# Altium schematic sheet CoreBoard.SchDoc
size A1
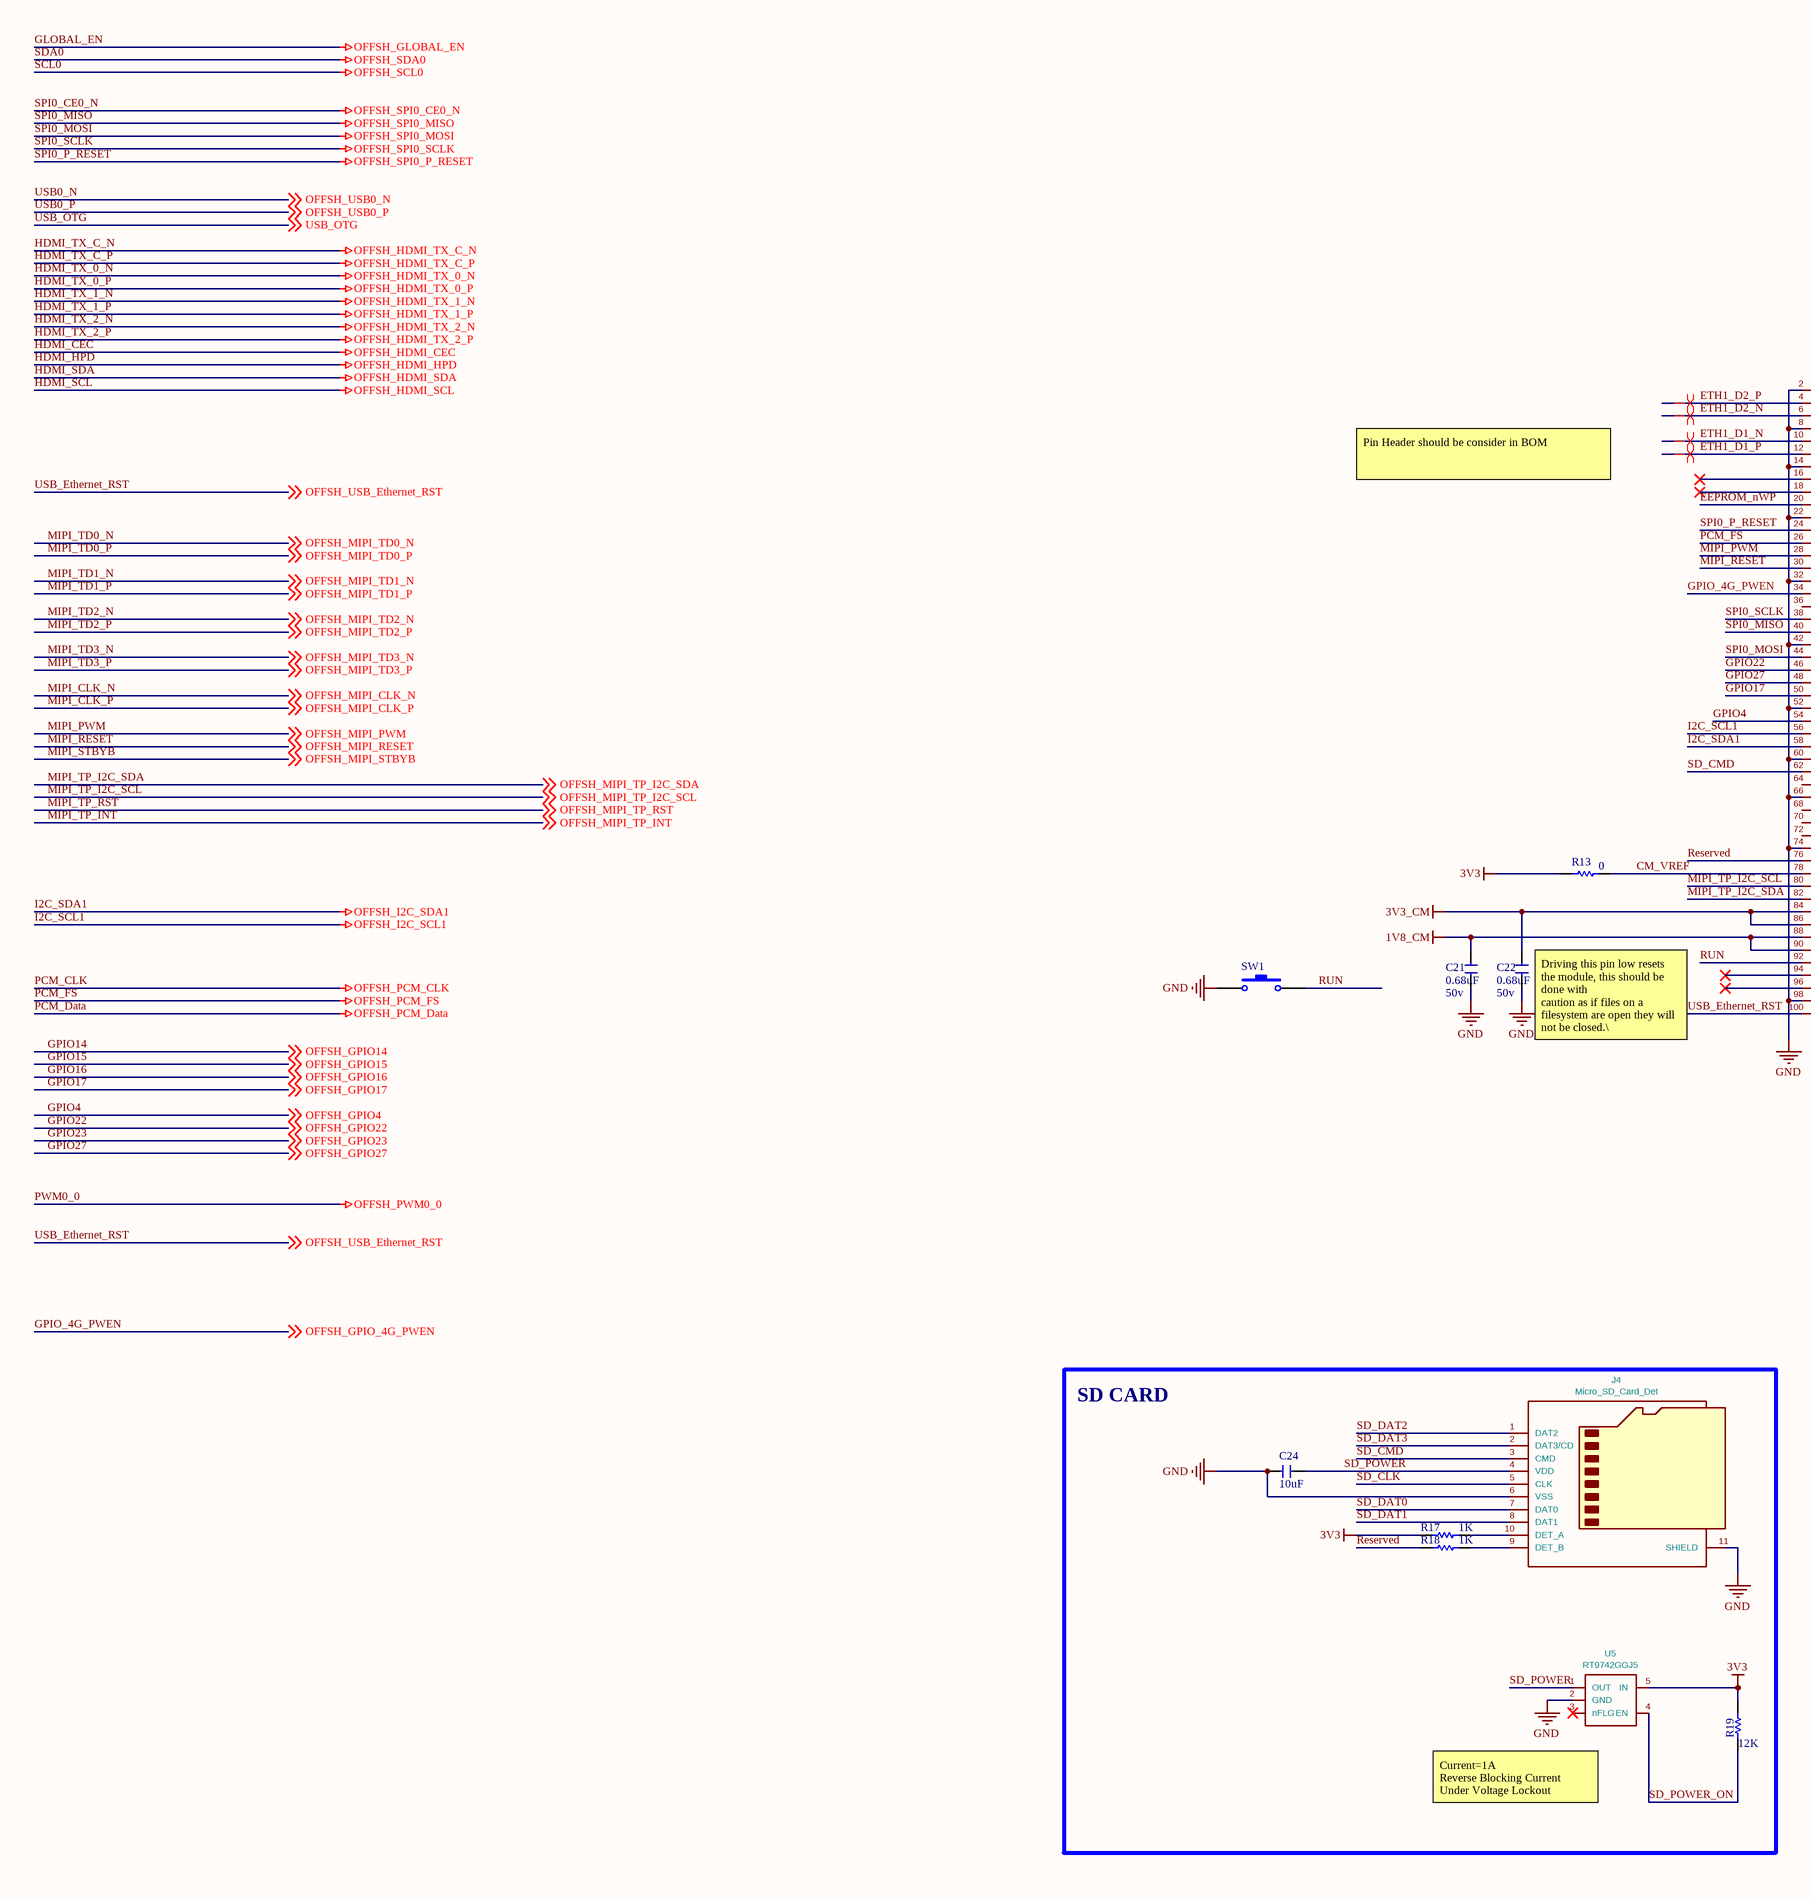
[diagram p0: CoreBoard.SchDoc, left]
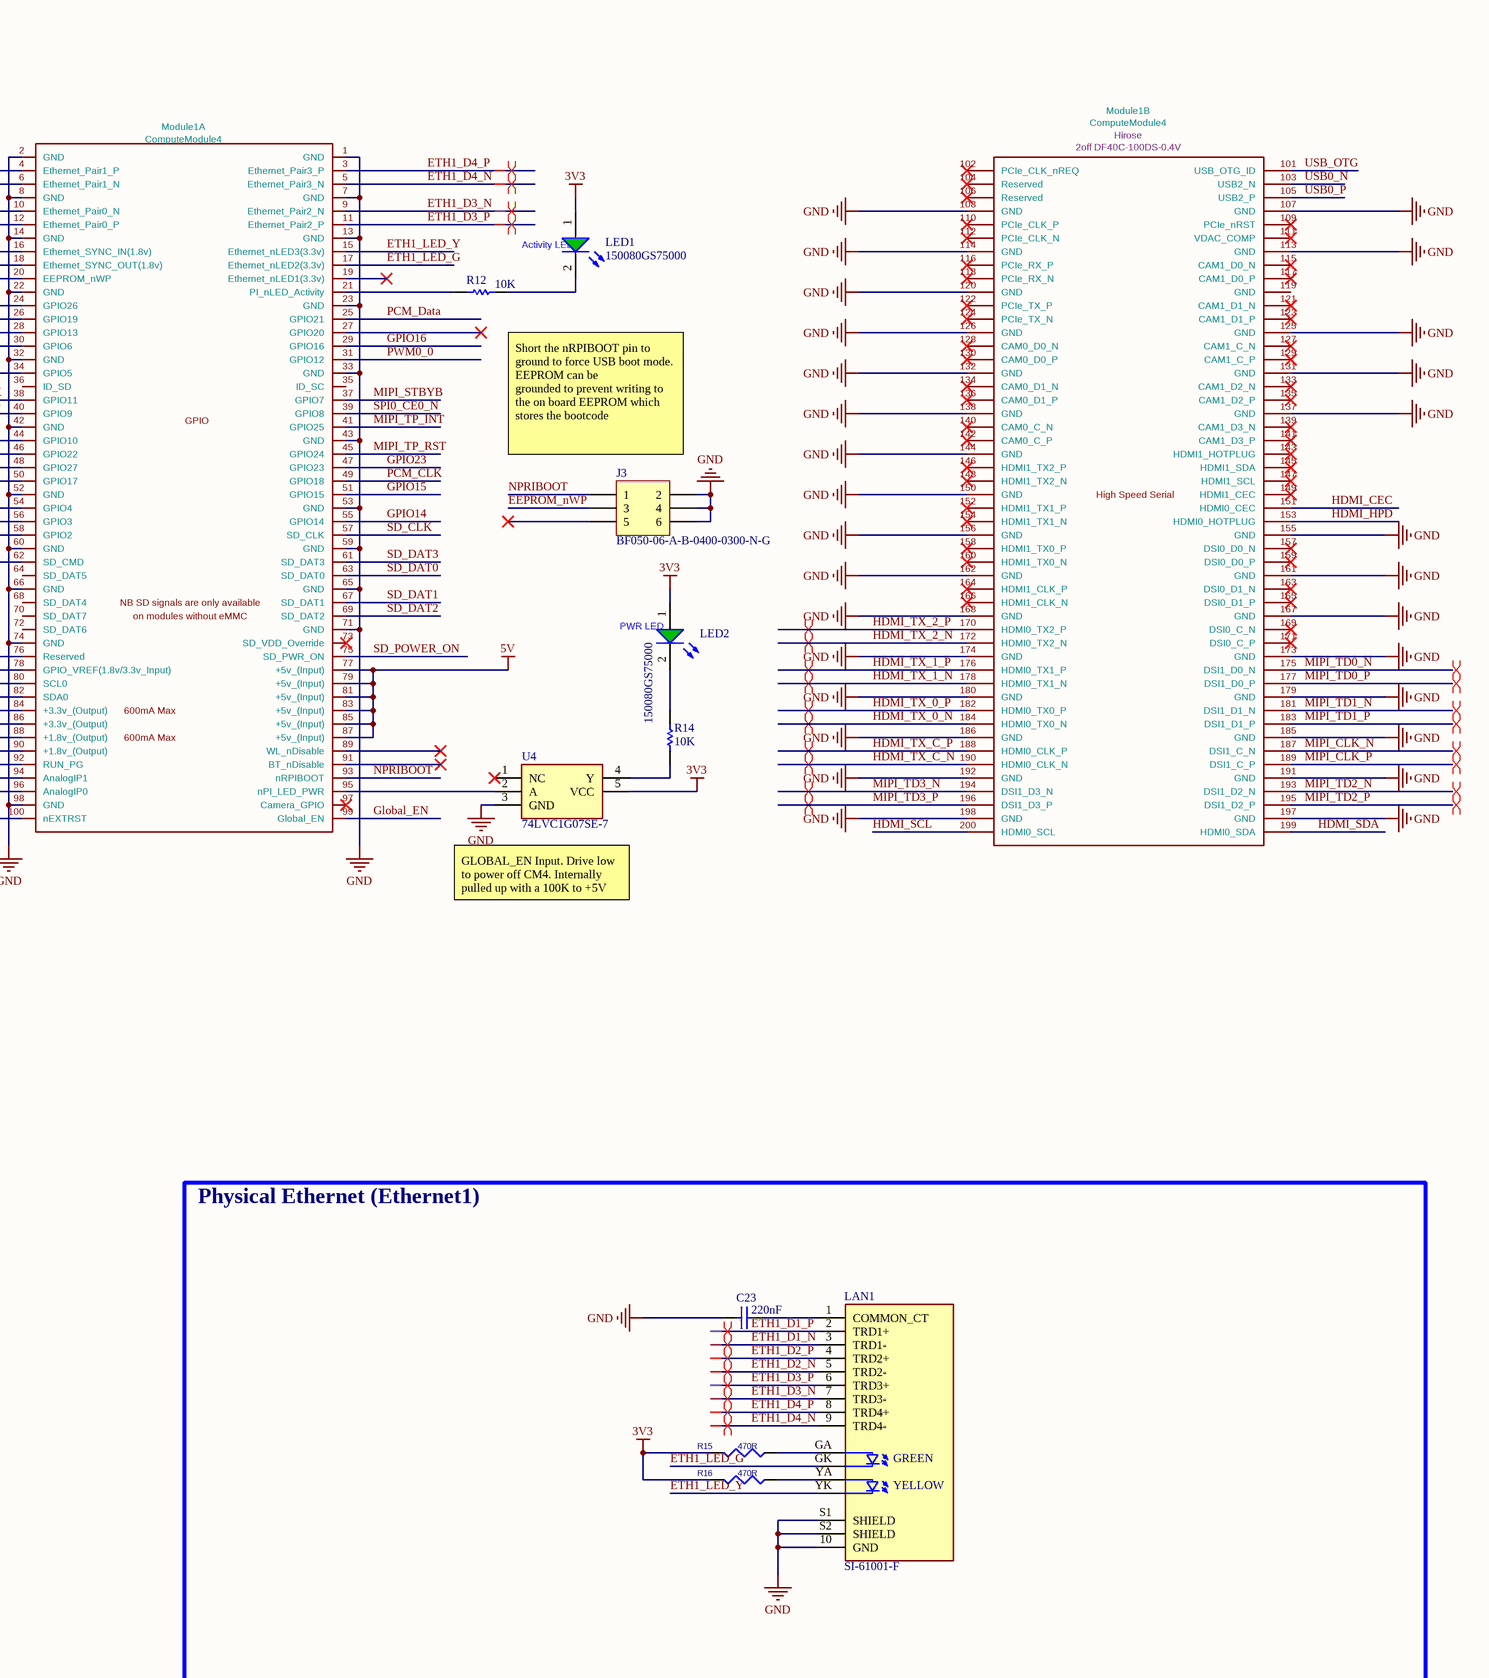
[diagram p1: CoreBoard.SchDoc, right]

## Parts
C21  value 0.68uF  Voltage: 50v  [0603 Capacitor]  (hidden comment: Capacitor SMD)
C22  value 0.68uF  Voltage: 50v  [0603 Capacitor]  (hidden comment: Capacitor SMD)
C23  value 220nF  [CAP (0603)]  (hidden comment: Cap)
C24  value 10uF  [0603 Capacitor]  (hidden comment: Capacitor SMD)
J3  Pin Header pitch 2.00 mm, 6 pin  [BF050-06-A-B-0400-0300-N-G]  (value not drawn)
J4  Micro_SD_Card_Det  [SDCARD_MOLEX_503398-1892]
LAN1  SI-61001-F  [BEL_SI-61001-F]
LED1  150080GS75000  [LED_0805_Green]
LED2  150080GS75000  [LED_0805_Green]
Module1  ComputeModule4  [Raspberry-Pi-4-Compute-Module]  (parts A,B of 2)
R12  value 10K  [R0603]  (hidden comment: Res)
R13  value 0  [R0603]  (hidden comment: Res)
R14  value 10K  [R0603]  (hidden comment: Res)
R15  470R  [R0603]
R16  470R  [R0603]
R17  value 1K  [R0603]  (hidden comment: Res)
R18  value 1K  [R0603]  (hidden comment: Res)
R19  value 12K  [R0603]  (hidden comment: Res)
SW1  (no value)  [Key_Tak Switch - Push to On]
U4  74LVC1G07SE-7  [SOT65P210X110-5N]
U5  RT9742GGJ5  [SOT-23-5]

## Blocks framed on the sheet
SD CARD: C24 J4 R17-R19 U5
Physical Ethernet (Ethernet1): C23 LAN1 R15 R16

## Nets
1V8_CM: C21.2 Module1.88(+1.8v_(Output)) Module1.90(+1.8v_(Output))
3V3: LED1.1(A) LED2.1(A) R13.2 R15.1 R16.1 R17.2 R19.2 U4.5(VCC) U5.5(IN)
3V3_CM: C22.2 Module1.84(+3.3v_(Output)) Module1.86(+3.3v_(Output))
5V: Module1.77(+5v_(Input)) Module1.79(+5v_(Input)) Module1.81(+5v_(Input)) Module1.83(+5v_(Input)) Module1.85(+5v_(Input)) Module1.87(+5v_(Input))
Global_EN: Module1.99(Global_EN)  [also labelled OFFSH_GLOBAL_EN]
GND: C21.1 C22.1 C23.1 C24.2 J3.2 J3.4 J3.6 J4.6(VSS) J4.11(SHIELD) LAN1.10(GND) LAN1.S1(SHIELD) LAN1.S2(SHIELD) Module1.1(GND) Module1.2(GND) Module1.7(GND) Module1.8(GND) Module1.13(GND) Module1.14(GND) Module1.22(GND) Module1.23(GND) Module1.32(GND) Module1.33(GND) Module1.42(GND) Module1.43(GND) Module1.52(GND) Module1.53(GND) Module1.59(GND) Module1.60(GND) Module1.65(GND) Module1.66(GND) Module1.71(GND) Module1.74(GND) Module1.98(GND) Module1.107(GND) Module1.108(GND) Module1.113(GND) Module1.114(GND) Module1.120(GND) Module1.125(GND) Module1.126(GND) Module1.131(GND) Module1.132(GND) Module1.137(GND) Module1.138(GND) Module1.144(GND) Module1.150(GND) Module1.155(GND) Module1.156(GND) Module1.161(GND) Module1.162(GND) Module1.167(GND) Module1.168(GND) Module1.173(GND) Module1.174(GND) Module1.179(GND) Module1.180(GND) Module1.185(GND) Module1.186(GND) Module1.191(GND) Module1.192(GND) Module1.197(GND) Module1.198(GND) SW1.1 U4.3(GND) U5.2(GND)
HDMI_CEC: Module1.151(HDMI0_CEC)  [also labelled OFFSH_HDMI_CEC]
HDMI_HPD: Module1.153(HDMI0_HOTPLUG)  [also labelled OFFSH_HDMI_HPD]
HDMI_SCL: Module1.200(HDMI0_SCL)  [also labelled OFFSH_HDMI_SCL]
HDMI_SDA: Module1.199(HDMI0_SDA)  [also labelled OFFSH_HDMI_SDA]
HDMI_TX_0_N: Module1.184(HDMI0_TX0_N)  [also labelled OFFSH_HDMI_TX_0_N]
HDMI_TX_0_P: Module1.182(HDMI0_TX0_P)  [also labelled OFFSH_HDMI_TX_0_P]
HDMI_TX_1_N: Module1.178(HDMI0_TX1_N)  [also labelled OFFSH_HDMI_TX_1_N]
HDMI_TX_1_P: Module1.176(HDMI0_TX1_P)  [also labelled OFFSH_HDMI_TX_1_P]
HDMI_TX_2_N: Module1.172(HDMI0_TX2_N)  [also labelled OFFSH_HDMI_TX_2_N]
HDMI_TX_2_P: Module1.170(HDMI0_TX2_P)  [also labelled OFFSH_HDMI_TX_2_P]
HDMI_TX_C_N: Module1.190(HDMI0_CLK_N)  [also labelled OFFSH_HDMI_TX_C_N]
HDMI_TX_C_P: Module1.188(HDMI0_CLK_P)  [also labelled OFFSH_HDMI_TX_C_P]
I2C_SCL1: Module1.56(GPIO3)  [also labelled OFFSH_I2C_SCL1]
I2C_SDA1: Module1.58(GPIO2)  [also labelled OFFSH_I2C_SDA1]
PCM_CLK: Module1.49(GPIO18)  [also labelled OFFSH_PCM_CLK]
PCM_Data: Module1.25(GPIO21)  [also labelled OFFSH_PCM_Data]
PCM_FS: Module1.26(GPIO19)  [also labelled OFFSH_PCM_FS]
PWM0_0: Module1.31(GPIO12)  [also labelled OFFSH_PWM0_0]
SPI0_CE0_N: Module1.39(GPIO8)  [also labelled OFFSH_SPI0_CE0_N]
SPI0_MISO: Module1.40(GPIO9)  [also labelled OFFSH_SPI0_MISO]
SPI0_MOSI: Module1.44(GPIO10)  [also labelled OFFSH_SPI0_MOSI]
SPI0_P_RESET: Module1.24(GPIO26)  [also labelled OFFSH_SPI0_P_RESET]
SPI0_SCLK: Module1.38(GPIO11)  [also labelled OFFSH_SPI0_SCLK]
CM_VREF: Module1.78(GPIO_VREF(1.8v/3.3v_Input)) R13.1
EEPROM_nWP: J3.3 Module1.20(EEPROM_nWP)
ETH1_D1_N: LAN1.3(TRD1-) Module1.10(Ethernet_Pair0_N)
ETH1_D1_P: LAN1.2(TRD1+) Module1.12(Ethernet_Pair0_P)
ETH1_D2_N: LAN1.5(TRD2-) Module1.6(Ethernet_Pair1_N)
ETH1_D2_P: LAN1.4(TRD2+) Module1.4(Ethernet_Pair1_P)
ETH1_D3_N: LAN1.7(TRD3-) Module1.9(Ethernet_Pair2_N)
ETH1_D3_P: LAN1.6(TRD3+) Module1.11(Ethernet_Pair2_P)
ETH1_D4_N: LAN1.9(TRD4-) Module1.5(Ethernet_Pair3_N)
ETH1_D4_P: LAN1.8(TRD4+) Module1.3(Ethernet_Pair3_P)
ETH1_LED_G: LAN1.GK Module1.17(Ethernet_nLED2(3.3v))
ETH1_LED_Y: LAN1.YK Module1.15(Ethernet_nLED3(3.3v))
GPIO4: Module1.54(GPIO4) ; off-sheet OFFSH_GPIO4  [also labelled OFFSH_GPIO4]
GPIO14: Module1.55(GPIO14) ; off-sheet OFFSH_GPIO14  [also labelled OFFSH_GPIO14]
GPIO15: Module1.51(GPIO15) ; off-sheet OFFSH_GPIO15  [also labelled OFFSH_GPIO15]
GPIO16: Module1.29(GPIO16) ; off-sheet OFFSH_GPIO16  [also labelled OFFSH_GPIO16]
GPIO17: Module1.50(GPIO17) ; off-sheet OFFSH_GPIO17  [also labelled OFFSH_GPIO17]
GPIO22: Module1.46(GPIO22) ; off-sheet OFFSH_GPIO22  [also labelled OFFSH_GPIO22]
GPIO23: Module1.47(GPIO23) ; off-sheet OFFSH_GPIO23  [also labelled OFFSH_GPIO23]
GPIO27: Module1.48(GPIO27) ; off-sheet OFFSH_GPIO27  [also labelled OFFSH_GPIO27]
GPIO_4G_PWEN: Module1.34(GPIO5) ; off-sheet OFFSH_GPIO_4G_PWEN  [also labelled OFFSH_GPIO_4G_PWEN]
MIPI_CLK_N: Module1.187(DSI1_C_N) ; off-sheet OFFSH_MIPI_CLK_N  [also labelled OFFSH_MIPI_CLK_N]
MIPI_CLK_P: Module1.189(DSI1_C_P) ; off-sheet OFFSH_MIPI_CLK_P  [also labelled OFFSH_MIPI_CLK_P]
MIPI_PWM: Module1.28(GPIO13) ; off-sheet OFFSH_MIPI_PWM  [also labelled OFFSH_MIPI_PWM]
MIPI_RESET: Module1.30(GPIO6) ; off-sheet OFFSH_MIPI_RESET  [also labelled OFFSH_MIPI_RESET]
MIPI_STBYB: Module1.37(GPIO7) ; off-sheet OFFSH_MIPI_STBYB  [also labelled OFFSH_MIPI_STBYB]
MIPI_TD0_N: Module1.175(DSI1_D0_N) ; off-sheet OFFSH_MIPI_TD0_N  [also labelled OFFSH_MIPI_TD0_N]
MIPI_TD0_P: Module1.177(DSI1_D0_P) ; off-sheet OFFSH_MIPI_TD0_P  [also labelled OFFSH_MIPI_TD0_P]
MIPI_TD1_N: Module1.181(DSI1_D1_N) ; off-sheet OFFSH_MIPI_TD1_N  [also labelled OFFSH_MIPI_TD1_N]
MIPI_TD1_P: Module1.183(DSI1_D1_P) ; off-sheet OFFSH_MIPI_TD1_P  [also labelled OFFSH_MIPI_TD1_P]
MIPI_TD2_N: Module1.193(DSI1_D2_N) ; off-sheet OFFSH_MIPI_TD2_N  [also labelled OFFSH_MIPI_TD2_N]
MIPI_TD2_P: Module1.195(DSI1_D2_P) ; off-sheet OFFSH_MIPI_TD2_P  [also labelled OFFSH_MIPI_TD2_P]
MIPI_TD3_N: Module1.194(DSI1_D3_N) ; off-sheet OFFSH_MIPI_TD3_N  [also labelled OFFSH_MIPI_TD3_N]
MIPI_TD3_P: Module1.196(DSI1_D3_P) ; off-sheet OFFSH_MIPI_TD3_P  [also labelled OFFSH_MIPI_TD3_P]
MIPI_TP_I2C_SCL: Module1.80(SCL0) ; off-sheet OFFSH_MIPI_TP_I2C_SCL  [also labelled OFFSH_MIPI_TP_I2C_SCL]
MIPI_TP_I2C_SDA: Module1.82(SDA0) ; off-sheet OFFSH_MIPI_TP_I2C_SDA  [also labelled OFFSH_MIPI_TP_I2C_SDA]
MIPI_TP_INT: Module1.41(GPIO25) ; off-sheet OFFSH_MIPI_TP_INT  [also labelled OFFSH_MIPI_TP_INT]
MIPI_TP_RST: Module1.45(GPIO24) ; off-sheet OFFSH_MIPI_TP_RST  [also labelled OFFSH_MIPI_TP_RST]
NPRIBOOT: J3.1 Module1.93(nRPIBOOT)
Reserved: Module1.76(Reserved) R18.2
RUN: Module1.92(RUN_PG) SW1.2
SD_CLK: J4.5(CLK) Module1.57(SD_CLK)
SD_CMD: J4.3(CMD) Module1.62(SD_CMD)
SD_DAT0: J4.7(DAT0) Module1.63(SD_DAT0)
SD_DAT1: J4.8(DAT1) Module1.67(SD_DAT1)
SD_DAT2: J4.1(DAT2) Module1.69(SD_DAT2)
SD_DAT3: J4.2(DAT3/CD) Module1.61(SD_DAT3)
SD_POWER: C24.1 J4.4(VDD) U5.1(OUT)
SD_POWER_ON: Module1.75(SD_PWR_ON) R19.1 U5.4(EN)
USB0_N: Module1.103(USB2_N) ; off-sheet OFFSH_USB0_N  [also labelled OFFSH_USB0_N]
USB0_P: Module1.105(USB2_P) ; off-sheet OFFSH_USB0_P  [also labelled OFFSH_USB0_P]
USB_Ethernet_RST: Module1.100(nEXTRST) ; off-sheet OFFSH_USB_Ethernet_RST  [also labelled OFFSH_USB_Ethernet_RST]
USB_OTG: Module1.101(USB_OTG_ID) ; off-sheet USB_OTG
NetC23_2: C23.2 LAN1.1(COMMON_CT)
NetJ4_9: J4.9(DET_B) R18.1
NetJ4_10: J4.10(DET_A) R17.1
NetLAN1_GA: LAN1.GA R15.2
NetLAN1_YA: LAN1.YA R16.2
NetLED1_2: LED1.2(C) R12.1
NetLED2_2: LED2.2(C) R14.1
NetModule1_21: Module1.21(PI_nLED_Activity) R12.2
NetModule1_95: Module1.95(nPI_LED_PWR) U4.2(A)
NetR14_2: R14.2 U4.4(Y)

Not connected (* = marked no-connect by the designer): J3 5*; Module1 16(Ethernet_SYNC_IN(1.8v))* 18(Ethernet_SYNC_OUT(1.8v))* 19(Ethernet_nLED1(3.3v))* 27(GPIO20)* 35(ID_SC) 36(ID_SD) 64(SD_DAT5) 68(SD_DAT4) 70(SD_DAT7) 72(SD_DAT6) 73(SD_VDD_Override)* 89(WL_nDisable)* 91(BT_nDisable)* 94(AnalogIP1)* 96(AnalogIP0)* 97(Camera_GPIO)* 102(PCIe_CLK_nREQ)* 104(Reserved)* 106(Reserved)* 109(PCIe_nRST)* 110(PCIe_CLK_P)* 111(VDAC_COMP)* 112(PCIe_CLK_N)* 115(CAM1_D0_N)* 116(PCIe_RX_P)* 117(CAM1_D0_P)* 118(PCIe_RX_N)* 119(GND) 121(CAM1_D1_N)* 122(PCIe_TX_P)* 123(CAM1_D1_P)* 124(PCIe_TX_N)* 127(CAM1_C_N)* 128(CAM0_D0_N)* 129(CAM1_C_P)* 130(CAM0_D0_P)* 133(CAM1_D2_N)* 134(CAM0_D1_N)* 135(CAM1_D2_P)* 136(CAM0_D1_P)* 139(CAM1_D3_N)* 140(CAM0_C_N)* 141(CAM1_D3_P)* 142(CAM0_C_P)* 143(HDMI1_HOTPLUG)* 145(HDMI1_SDA)* 146(HDMI1_TX2_P)* 147(HDMI1_SCL)* 148(HDMI1_TX2_N)* 149(HDMI1_CEC)* 152(HDMI1_TX1_P)* 154(HDMI1_TX1_N)* 157(DSI0_D0_N)* 158(HDMI1_TX0_P)* 159(DSI0_D0_P)* 160(HDMI1_TX0_N)* 163(DSI0_D1_N)* 164(HDMI1_CLK_P)* 165(DSI0_D1_P)* 166(HDMI1_CLK_N)* 169(DSI0_C_N)* 171(DSI0_C_P)*; U4 1(NC)*; U5 3(nFLG)*

## Layout directives
differential pair; net class MIPI: MIPI_CLK_N, MIPI_CLK_P, MIPI_TD0_N, MIPI_TD0_P, MIPI_TD1_N, MIPI_TD1_P, MIPI_TD2_N, MIPI_TD2_P
differential pair: ETH1_D1_N, ETH1_D1_P, ETH1_D2_N, ETH1_D2_P, ETH1_D3_N, ETH1_D3_P, ETH1_D4_N, ETH1_D4_P, HDMI_TX_0_N, HDMI_TX_0_P, HDMI_TX_1_N, HDMI_TX_1_P, HDMI_TX_2_N, HDMI_TX_2_P, HDMI_TX_C_N, HDMI_TX_C_P, MIPI_TD3_N, MIPI_TD3_P

## Notes on the sheet
- Pin Header should be consider in BOM
- (near LED1) Activity LED
- Short the nRPIBOOT pin to ground to force USB boot mode.                                                                     EEPROM can be
  grounded to prevent writing to the on board EEPROM which stores the bootcode
- (near LED2) PWR LED
- (near C22) Driving this pin low resets the module, this should be done with
  caution as if files on a filesystem are open they will not be closed.\
- (near U4) GLOBAL_EN Input. Drive low to power off CM4. Internally pulled up with a 100K to +5V
- (near U5) Current=1A
  Reverse Blocking Current
  Under Voltage Lockout
- (in symbol ComputeModule4-CM4, part A) GPIO; NB SD signals are only available; on modules without eMMC; 600mA Max
- (in symbol ComputeModule4-CM4, part B) High Speed Serial
- (in symbol SI-61001-F) GREEN; YELLOW

## Library data of the parts
C23 = Cap: SMD capacitor; Part Number: SMD CAP (0603)
C24 = Capacitor SMD: Voltage: 50v
J3 = BF050-06-A-B-0400-0300-N-G: Pin Number: 6; Pitch: 2.00 mm; Row Number: Dual; Link: https://gct.co/connector/bf050; Part Number: BF050-06-A-B-0400-0300-N-G
J4 = Micro_SD_Card_Det: Part Description: 9 (8 + 1) Position Card Connector microSD™ Surface Mount, Right Angle Gold; Field4: Farnell; Field5: 2358234; Field6: 503398-1892; Field7: Molex; Field8: UCON00512; Value: Micro_SD_Card_Det; Footprint: CM4IO:SDCARD_MOLEX_503398-1892
LAN1 = SI-61001-F: Conn RJ-45 RCP 8 POS 1.27mm Solder RA Thru-Hole 14 Terminal 1 Port; MF: Bel Magnetic Solutions; Value: *; MP: SI-61001-F; Price: None; Availability: Unavailable; Package: None; SnapEDA_Link: https://www.snapeda.com/parts/SI-61001-F/Bel%20Magnetic%20Solutions/view-part/4791152/?ref=snap
LED1 LED2 = WL-SMCW 0805  150080GS75000: SMD mono-color Chip LED, WL-SMCW, Green; Manufacturer: W黵th Elektronik eiSos GmbH; PartNo: 150080GS75000; ComponentLink1Description: Manufacturer; ComponentLink1URL: http://www.we-online.de; Created by: Christin Otto; Created Date: June 2013; ComponentLink2Description: Datasheet; ComponentLink2URL: http://katalog.we-online.com/led/datasheet/150080GS75000.pdf; Color: Green
Module1 = ComputeModule4-CM4: Part Description: 100 Position Connector Receptacle, Center Strip Contacts Surface Mount Gold; Field4: Hirose; Field5: 2off DF40C-100DS-0.4V; Field6: 2off DF40C-100DS-0.4V; Field7: Hirose; Value: ComputeModule4; Footprint: CM4IO:Raspberry-Pi-4-Compute-Module
R12-R14 R17-R19 = Res: Resistor; Published: 8-Jun-2000; LatestRevisionDate: 17-Jul-2002; LatestRevisionNote: Re-released for DXP Platform.; PackageReference: AXIAL-0.3; Publisher: Altium Limited
R15 R16 = RES: Value: 470
SW1 = SW-PB: Switch; Published: 24-Mar-1999; LatestRevisionDate: 17-Jul-2002; LatestRevisionNote: Re-released for DXP Platform.; PackageReference: SPST-2; Publisher: Altium Limited; PackageDescription: Switch; 2 Leads
U4 = 74LVC1G07SE-7: Undefined or Miscellaneous; Manufacturer_Name: Diodes Inc.; Datasheet Link: https://componentsearchengine.com/Datasheets/2/74LVC1G07SE-7.pdf; Height: 1.1mm; Manufacturer_Part_Number: 74LVC1G07SE-7; Mouser Part Number: 621-74LVC1G07SE-7; Mouser Price/Stock: https://www.mouser.co.uk/ProductDetail/Diodes-Incorporated/74LVC1G07SE-7?qs=abZ1nkZpTuNoZmx9wrxFdA%3D%3D; Arrow Part Number: 74LVC1G07SE-7; Arrow Price/Stock: https://www.arrow.com/en/products/74lvc1g07se-7/diodes-incorporated
U5 = RT9742GGJ5: Part Description: Power Switch/Driver 1:1 N-Channel 1A TSOT-23-5; Field4: Farnell; Field5: 2545875; Field7: RichTek; Field8: USWI00166; Field6: RT9742GGJ5; Value: RT9742GGJ5; Footprint: Package_TO_SOT_SMD:SOT-23-5